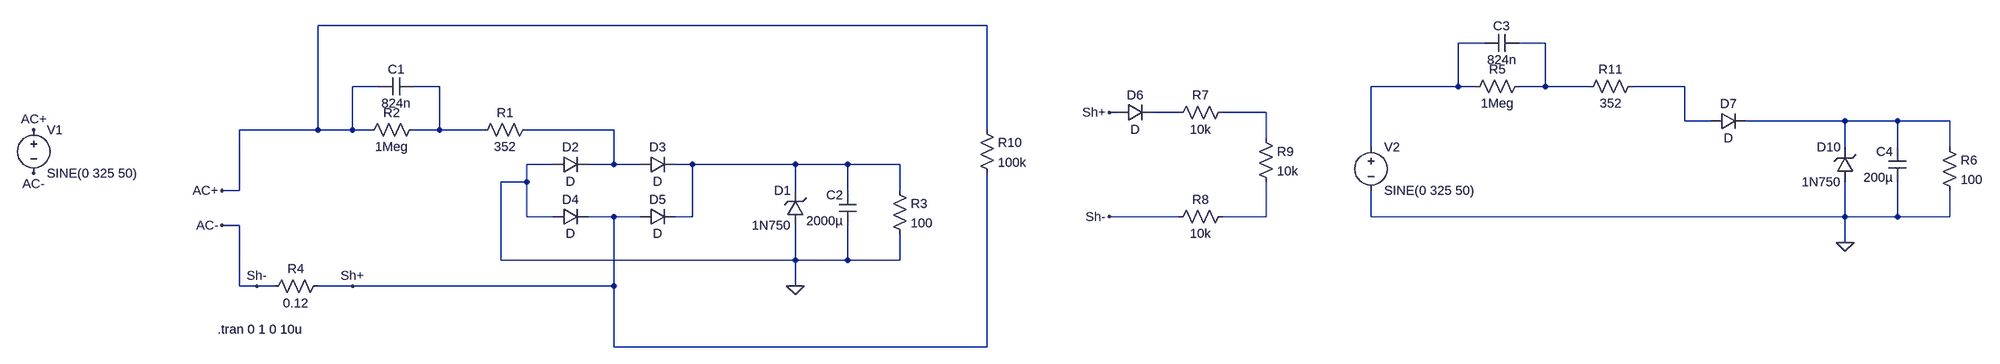
[diagram p0: schematic schematic_converter.asc]
schematic_converter.asc, the LTspice schematic file:
Version 4
SHEET 1 3460 872
WIRE 1248 -176 16 -176
WIRE 2496 -144 2448 -144
WIRE 2608 -144 2560 -144
WIRE 128 -64 80 -64
WIRE 240 -64 192 -64
WIRE 2448 -64 2448 -144
WIRE 2448 -64 2288 -64
WIRE 2480 -64 2448 -64
WIRE 2608 -64 2608 -144
WIRE 2608 -64 2560 -64
WIRE 2688 -64 2608 -64
WIRE 2864 -64 2768 -64
WIRE 1520 -16 1504 -16
WIRE 1632 -16 1584 -16
WIRE 1792 -16 1712 -16
WIRE 2864 0 2864 -64
WIRE 2912 0 2864 0
WIRE 3200 0 2976 0
WIRE 3296 0 3200 0
WIRE 3392 0 3296 0
WIRE 16 16 16 -176
WIRE 16 16 -128 16
WIRE 80 16 80 -64
WIRE 80 16 16 16
WIRE 112 16 80 16
WIRE 240 16 240 -64
WIRE 240 16 192 16
WIRE 320 16 240 16
WIRE 560 16 400 16
WIRE 1248 16 1248 -176
WIRE 1792 32 1792 -16
WIRE 2288 48 2288 -64
WIRE 3200 48 3200 0
WIRE 3296 48 3296 0
WIRE 3392 48 3392 0
WIRE 448 80 400 80
WIRE 560 80 560 16
WIRE 560 80 512 80
WIRE 608 80 560 80
WIRE 704 80 672 80
WIRE 896 80 704 80
WIRE 992 80 896 80
WIRE 1088 80 992 80
WIRE 400 112 400 80
WIRE 400 112 352 112
WIRE -128 128 -128 16
WIRE -128 128 -160 128
WIRE 896 128 896 80
WIRE 992 128 992 80
WIRE 1088 128 1088 80
WIRE 400 176 400 112
WIRE 448 176 400 176
WIRE 560 176 512 176
WIRE 608 176 560 176
WIRE 704 176 704 80
WIRE 704 176 672 176
WIRE 1632 176 1504 176
WIRE 1792 176 1792 112
WIRE 1792 176 1712 176
WIRE 2288 176 2288 128
WIRE 3200 176 3200 112
WIRE 3200 176 2288 176
WIRE 3296 176 3296 112
WIRE 3296 176 3200 176
WIRE 3392 176 3392 128
WIRE 3392 176 3296 176
WIRE -128 192 -160 192
WIRE 3200 224 3200 176
WIRE 352 256 352 112
WIRE 896 256 896 192
WIRE 896 256 352 256
WIRE 992 256 992 192
WIRE 992 256 896 256
WIRE 1088 256 1088 208
WIRE 1088 256 992 256
WIRE -128 304 -128 192
WIRE -96 304 -128 304
WIRE -64 304 -96 304
WIRE 80 304 16 304
WIRE 560 304 560 176
WIRE 560 304 80 304
WIRE 896 304 896 256
WIRE 560 416 560 304
WIRE 1248 416 1248 96
WIRE 1248 416 560 416
FLAG 896 304 0
FLAG 3200 224 0
FLAG -592 16 AC+
FLAG -592 96 AC-
FLAG -160 128 AC+
FLAG -160 192 AC-
FLAG 80 304 Sh+
FLAG -96 304 Sh-
FLAG 1504 -16 Sh+
FLAG 1504 176 Sh-
SYMBOL voltage -592 0 R0
WINDOW 123 0 0 Left 0
WINDOW 39 0 0 Left 0
SYMATTR InstName V1
SYMATTR Value SINE(0 325 50)
SYMBOL res 208 0 R90
WINDOW 0 0 56 VBottom 2
WINDOW 3 32 56 VTop 2
SYMATTR InstName R2
SYMATTR Value 1Meg
SYMBOL cap 192 -80 R90
WINDOW 0 0 32 VBottom 2
WINDOW 3 32 32 VTop 2
SYMATTR InstName C1
SYMATTR Value 824n
SYMATTR SpiceLine ic 230
SYMBOL res 416 0 R90
WINDOW 0 0 56 VBottom 2
WINDOW 3 32 56 VTop 2
SYMATTR InstName R1
SYMATTR Value 352
SYMBOL diode 448 96 R270
WINDOW 0 32 32 VTop 2
WINDOW 3 0 32 VBottom 2
SYMATTR InstName D2
SYMBOL diode 608 96 R270
WINDOW 0 32 32 VTop 2
WINDOW 3 0 32 VBottom 2
SYMATTR InstName D3
SYMBOL diode 448 192 R270
WINDOW 0 32 32 VTop 2
WINDOW 3 0 32 VBottom 2
SYMATTR InstName D4
SYMBOL diode 608 192 R270
WINDOW 0 32 32 VTop 2
WINDOW 3 0 32 VBottom 2
SYMATTR InstName D5
SYMBOL zener 912 192 R180
WINDOW 0 24 64 Left 2
WINDOW 3 24 0 Left 2
SYMATTR InstName D1
SYMATTR Value 1N750
SYMATTR Description Diode
SYMATTR Type diode
SYMBOL cap 1008 192 R180
WINDOW 0 24 56 Left 2
WINDOW 3 24 8 Left 2
SYMATTR InstName C2
SYMATTR Value 2000µ
SYMATTR SpiceLine IC 10
SYMBOL res 1072 112 R0
SYMATTR InstName R3
SYMATTR Value 100
SYMBOL voltage 2288 32 R0
WINDOW 123 0 0 Left 0
WINDOW 39 0 0 Left 0
SYMATTR InstName V2
SYMATTR Value SINE(0 325 50)
SYMBOL diode 2912 16 R270
WINDOW 0 32 32 VTop 2
WINDOW 3 0 32 VBottom 2
SYMATTR InstName D7
SYMBOL zener 3216 112 R180
WINDOW 0 24 64 Left 2
WINDOW 3 24 0 Left 2
SYMATTR InstName D10
SYMATTR Value 1N750
SYMATTR Description Diode
SYMATTR Type diode
SYMBOL cap 3312 112 R180
WINDOW 0 24 56 Left 2
WINDOW 3 24 8 Left 2
SYMATTR InstName C4
SYMATTR Value 200µ
SYMATTR SpiceLine IC 0
SYMBOL res 3376 32 R0
SYMATTR InstName R6
SYMATTR Value 100
SYMBOL res 1728 -32 R90
WINDOW 0 0 56 VBottom 2
WINDOW 3 32 56 VTop 2
SYMATTR InstName R7
SYMATTR Value 10k
SYMBOL res 1728 160 R90
WINDOW 0 0 56 VBottom 2
WINDOW 3 32 56 VTop 2
SYMATTR InstName R8
SYMATTR Value 10k
SYMBOL res 1776 16 R0
SYMATTR InstName R9
SYMATTR Value 10k
SYMBOL res 32 288 R90
WINDOW 0 0 56 VBottom 2
WINDOW 3 32 56 VTop 2
SYMATTR InstName R4
SYMATTR Value 0.12
SYMBOL res 1232 0 R0
SYMATTR InstName R10
SYMATTR Value 100k
SYMBOL diode 1520 0 R270
WINDOW 0 32 32 VTop 2
WINDOW 3 0 32 VBottom 2
SYMATTR InstName D6
SYMBOL res 2576 -80 R90
WINDOW 0 0 56 VBottom 2
WINDOW 3 32 56 VTop 2
SYMATTR InstName R5
SYMATTR Value 1Meg
SYMBOL cap 2560 -160 R90
WINDOW 0 0 32 VBottom 2
WINDOW 3 32 32 VTop 2
SYMATTR InstName C3
SYMATTR Value 824n
SYMATTR SpiceLine IC 230
SYMBOL res 2784 -80 R90
WINDOW 0 0 56 VBottom 2
WINDOW 3 32 56 VTop 2
SYMATTR InstName R11
SYMATTR Value 352
TEXT -168 384 Left 2 !.tran 0 1 0 10u

The netlist it stands for:
* schematic_converter.asc
V1 AC+ Sh- SINE(0 325 50)
R2 N003 AC+ 1Meg
C1 N003 AC+ 824n ic 230
R1 N008 N003 352
D2 0 N008 D
D3 N008 N009 D
D4 0 Sh+ D
D5 Sh+ N009 D
D1 0 N009 1N750
C2 0 N009 2000µ IC 10
R3 N009 0 100
V2 N001 0 SINE(0 325 50)
D7 N004 N007 D
D10 0 N007 1N750
C4 0 N007 200µ IC 0
R6 N007 0 100
R7 N006 N005 10k
R8 N010 Sh- 10k
R9 N006 N010 10k
R4 Sh+ Sh- 0.12
R10 AC+ Sh+ 100k
D6 Sh+ N005 D
R5 N002 N001 1Meg
C3 N002 N001 824n IC 230
R11 N004 N002 352
.model D D
.lib standard.dio
.tran 0 1 0 10u
.backanno
.end